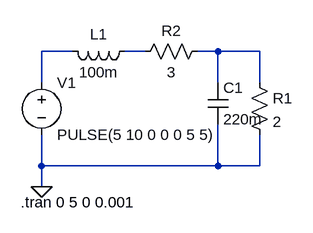
[diagram p0: schematic StepDownConverter.asc]
StepDownConverter.asc, the LTspice schematic file:
Version 4
SHEET 1 880 680
WIRE 112 0 64 0
WIRE 224 0 192 0
WIRE 336 0 304 0
WIRE 400 0 336 0
WIRE 64 48 64 0
WIRE 336 48 336 0
WIRE 400 48 400 0
WIRE 64 176 64 128
WIRE 336 176 336 112
WIRE 336 176 64 176
WIRE 400 176 400 128
WIRE 400 176 336 176
WIRE 64 208 64 176
FLAG 64 208 0
SYMBOL res 384 32 R0
SYMATTR InstName R1
SYMATTR Value 2
SYMBOL res 320 -16 R90
WINDOW 0 0 56 VBottom 2
WINDOW 3 32 56 VTop 2
SYMATTR InstName R2
SYMATTR Value 3
SYMBOL voltage 64 32 R0
WINDOW 123 0 0 Left 0
WINDOW 39 0 0 Left 0
SYMATTR InstName V1
SYMATTR Value PULSE(5 10 0 0 0 5 5)
SYMBOL ind 208 -16 R90
WINDOW 0 5 56 VBottom 2
WINDOW 3 32 56 VTop 2
SYMATTR InstName L1
SYMATTR Value 100m
SYMBOL cap 320 48 R0
SYMATTR InstName C1
SYMATTR Value 220m
TEXT 32 232 Left 2 !.tran 0 5 0 0.001

The netlist it stands for:
* StepDownConverter.asc
R1 N003 0 2
R2 N003 N002 3
V1 N001 0 PULSE(5 10 0 0 0 5 5)
L1 N002 N001 100m
C1 N003 0 220m
.tran 0 5 0 0.001
.backanno
.end